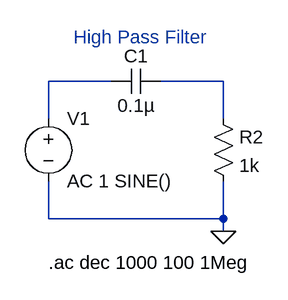
[diagram p0: schematic 3EEC_VELASCO_EXPT7_CKT2.asc]
3EEC_VELASCO_EXPT7_CKT2.asc, the LTspice schematic file:
Version 4
SHEET 1 880 680
WIRE 96 96 16 96
WIRE 240 96 160 96
WIRE 16 144 16 96
WIRE 240 144 240 96
WIRE 16 272 16 224
WIRE 240 272 240 224
WIRE 240 272 16 272
WIRE 240 288 240 272
FLAG 240 288 0
SYMBOL voltage 16 128 R0
SYMATTR InstName V1
SYMATTR Value AC 1 SINE()
SYMBOL res 224 128 R0
SYMATTR InstName R2
SYMATTR Value 1k
SYMBOL cap 160 80 R90
WINDOW 0 0 32 VBottom 2
WINDOW 3 32 32 VTop 2
SYMATTR InstName C1
SYMATTR Value 0.1µ
TEXT 16 328 Left 2 !.ac dec 1000 100 1Meg
TEXT 48 40 Left 2 ;High Pass Filter

The netlist it stands for:
* 3EEC_VELASCO_EXPT7_CKT2.asc
V1 N001 0 AC 1 SINE()
R2 N002 0 1k
C1 N002 N001 0.1µ
.ac dec 1000 100 1Meg
* High Pass Filter
.backanno
.end